# Altium project upscal.PrjPcb
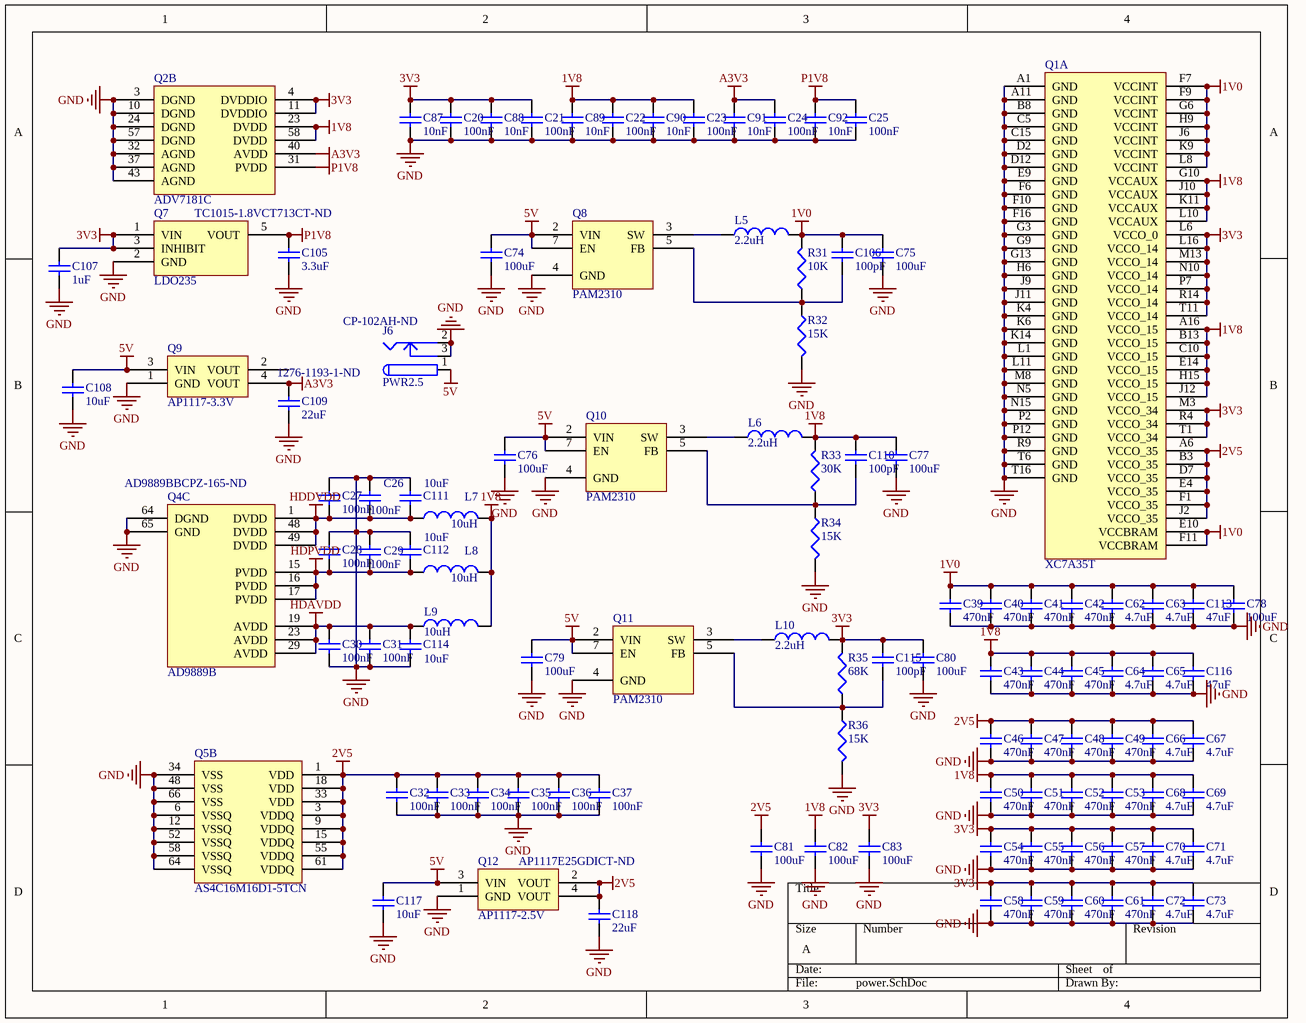
[diagram p0: power.SchDoc]
6 sheets, 230 parts. Net scope: global (net labels, ports and power ports of the same name join across sheets).
Board file: pcb.PcbDoc
Sheets:
  power.SchDoc
  input.SchDoc
  fpga.SchDoc
  hdmi.SchDoc
  mem.SchDoc
  io.SchDoc

## Sheet power.SchDoc
size A

### Parts
C20  value 100nF  [CAPC1005X06L]  (hidden comment: Cap)
C21  value 100nF  [CAPC1005X06L]  (hidden comment: Cap)
C22  value 100nF  [CAPC1005X06L]  (hidden comment: Cap)
C23  value 100nF  [CAPC1005X06L]  (hidden comment: Cap)
C24  value 100nF  [CAPC1005X06L]  (hidden comment: Cap)
C25  value 100nF  [CAPC1005X06L]  (hidden comment: Cap)
C26  value 100nF  [CAPC1005X06L]  (hidden comment: Cap)
C27  value 100nF  [CAPC1005X06L]  (hidden comment: Cap)
C28  value 100nF  [CAPC1005X06L]  (hidden comment: Cap)
C29  value 100nF  [CAPC1005X06L]  (hidden comment: Cap)
C30  value 100nF  [CAPC1005X06L]  (hidden comment: Cap)
C31  value 100nF  [CAPC1005X06L]  (hidden comment: Cap)
C32  value 100nF  [CAPC1005X06L]  (hidden comment: Cap)
C33  value 100nF  [CAPC1005X06L]  (hidden comment: Cap)
C34  value 100nF  [CAPC1005X06L]  (hidden comment: Cap)
C35  value 100nF  [CAPC1005X06L]  (hidden comment: Cap)
C36  value 100nF  [CAPC1005X06L]  (hidden comment: Cap)
C37  value 100nF  [CAPC1005X06L]  (hidden comment: Cap)
C39  value 470nF  [CAPC1005X06L]  (hidden comment: Cap)
C40  value 470nF  [CAPC1005X06L]  (hidden comment: Cap)
C41  value 470nF  [CAPC1005X06L]  (hidden comment: Cap)
C42  value 470nF  [CAPC1005X06L]  (hidden comment: Cap)
C43  value 470nF  [CAPC1005X06L]  (hidden comment: Cap)
C44  value 470nF  [CAPC1005X06L]  (hidden comment: Cap)
C45  value 470nF  [CAPC1005X06L]  (hidden comment: Cap)
C46  value 470nF  [CAPC1005X06L]  (hidden comment: Cap)
C47  value 470nF  [CAPC1005X06L]  (hidden comment: Cap)
C48  value 470nF  [CAPC1005X06L]  (hidden comment: Cap)
C49  value 470nF  [CAPC1005X06L]  (hidden comment: Cap)
C50  value 470nF  [CAPC1005X06L]  (hidden comment: Cap)
C51  value 470nF  [CAPC1005X06L]  (hidden comment: Cap)
C52  value 470nF  [CAPC1005X06L]  (hidden comment: Cap)
C53  value 470nF  [CAPC1005X06L]  (hidden comment: Cap)
C54  value 470nF  [CAPC1005X06L]  (hidden comment: Cap)
C55  value 470nF  [CAPC1005X06L]  (hidden comment: Cap)
C56  value 470nF  [CAPC1005X06L]  (hidden comment: Cap)
C57  value 470nF  [CAPC1005X06L]  (hidden comment: Cap)
C58  value 470nF  [CAPC1005X06L]  (hidden comment: Cap)
C59  value 470nF  [CAPC1005X06L]  (hidden comment: Cap)
C60  value 470nF  [CAPC1005X06L]  (hidden comment: Cap)
C61  value 470nF  [CAPC1005X06L]  (hidden comment: Cap)
C62  value 4.7uF  [CAPC1608X90N]  (hidden comment: Cap)
C63  value 4.7uF  [CAPC1608X90N]  (hidden comment: Cap)
C64  value 4.7uF  [CAPC1608X90N]  (hidden comment: Cap)
C65  value 4.7uF  [CAPC1608X90N]  (hidden comment: Cap)
C66  value 4.7uF  [CAPC1608X90N]  (hidden comment: Cap)
C67  value 4.7uF  [CAPC1608X90N]  (hidden comment: Cap)
C68  value 4.7uF  [CAPC1608X90N]  (hidden comment: Cap)
C69  value 4.7uF  [CAPC1608X90N]  (hidden comment: Cap)
C70  value 4.7uF  [CAPC1608X90N]  (hidden comment: Cap)
C71  value 4.7uF  [CAPC1608X90N]  (hidden comment: Cap)
C72  value 4.7uF  [CAPC1608X90N]  (hidden comment: Cap)
C73  value 4.7uF  [CAPC1608X90N]  (hidden comment: Cap)
C74  value 100uF  [CAPC3216X100N]  (hidden comment: Cap)
C75  value 100uF  [CAPC3216X100N]  (hidden comment: Cap)
C76  value 100uF  [CAPC3216X100N]  (hidden comment: Cap)
C77  value 100uF  [CAPC3216X100N]  (hidden comment: Cap)
C78  value 100uF  [CAPC3216X100N]  (hidden comment: Cap)
C79  value 100uF  [CAPC3216X100N]  (hidden comment: Cap)
C80  value 100uF  [CAPC3216X100N]  (hidden comment: Cap)
C81  value 100uF  [CAPC3216X100N]  (hidden comment: Cap)
C82  value 100uF  [CAPC3216X100N]  (hidden comment: Cap)
C83  value 100uF  [CAPC3216X100N]  (hidden comment: Cap)
C87  value 10nF  [CAPC1005X06L]  (hidden comment: Cap)
C88  value 10nF  [CAPC1005X06L]  (hidden comment: Cap)
C89  value 10nF  [CAPC1005X06L]  (hidden comment: Cap)
C90  value 10nF  [CAPC1005X06L]  (hidden comment: Cap)
C91  value 10nF  [CAPC1005X06L]  (hidden comment: Cap)
C92  value 10nF  [CAPC1005X06L]  (hidden comment: Cap)
C105  value 3.3uF  [CAPC1608X90N]  (hidden comment: Cap)
C106  value 100pF  [CAPC1608X90N]  (hidden comment: Cap)
C107  value 1uF  [CAPC1608X90N]  (hidden comment: Cap)
C108  value 10uF  [CAPC1608X90N]  (hidden comment: Cap)
C109  value 22uF  Supplier Part Number 1: 1276-1193-1-ND  [CAPC1608X90N]  (hidden comment: Cap)
C110  value 100pF  [CAPC1608X90N]  (hidden comment: Cap)
C111  value 10uF  [CAPC1608X90N]  (hidden comment: Cap)
C112  value 10uF  [CAPC1608X90N]  (hidden comment: Cap)
C113  value 47uF  [CAPC2012X135N]  (hidden comment: Cap)
C114  value 10uF  [CAPC1608X90N]  (hidden comment: Cap)
C115  value 100pF  [CAPC1608X90N]  (hidden comment: Cap)
C116  value 47uF  [CAPC2012X135N]  (hidden comment: Cap)
C117  value 10uF  [CAPC1608X90N]  (hidden comment: Cap)
C118  value 22uF  [CAPC1608X90N]  (hidden comment: Cap)
J6  PWR2.5  Supplier Part Number 1: CP-102AH-ND  [PJ-102A]
L5  value 2.2uH  [NRS8030T2R2NJGJ]  (hidden comment: NRS8030T2R2NJGJ)
L6  value 2.2uH  [NRS8030T2R2NJGJ]  (hidden comment: NRS8030T2R2NJGJ)
L7  value 10uH  [CAPC3225X220N]  (hidden comment: LBC3225T100KR)
L8  value 10uH  [CAPC3225X220N]  (hidden comment: LBC3225T100KR)
L9  value 10uH  [CAPC3225X220N]  (hidden comment: LBC3225T100KR)
L10  value 2.2uH  [NRS8030T2R2NJGJ]  (hidden comment: NRS8030T2R2NJGJ)
Q1  XC7A35T  (part A of 6)
Q2  ADV7181C  [TSQFP50P1200X1200X145-64N]  (part B of 3)
Q4  AD9889B  Supplier Part Number 1: AD9889BBCPZ-165-ND  [QFN50P900X875X100_HS-65N]  (part C of 3)
Q5  AS4C16M16D1-5TCN  [TSOP65P1180X120-66N]  (part B of 2)
Q7  LDO235  Supplier Part Number 1: TC1015-1.8VCT713CT-ND  [SOT23-5]
Q8  PAM2310  [SOIC127P600X175-8AN]
Q9  AP1117-3.3V  [SOT223]
Q10  PAM2310  [SOIC127P600X175-8AN]
Q11  PAM2310  [SOIC127P600X175-8AN]
Q12  AP1117-2.5V  Supplier Part Number 1: AP1117E25GDICT-ND  [SOT223]
R31  value 10K  [CAPC1608X90N]  (hidden comment: Res3)
R32  value 15K  [CAPC1608X90N]  (hidden comment: Res3)
R33  value 30K  [CAPC1608X90N]  (hidden comment: Res3)
R34  value 15K  [CAPC1608X90N]  (hidden comment: Res3)
R35  value 68K  [CAPC1608X90N]  (hidden comment: Res3)
R36  value 15K  [CAPC1608X90N]  (hidden comment: Res3)

### Nets
1V0: C39.2 C40.2 C41.2 C42.2 C62.1 C63.1 C75.1 C78.1 C106.1 C113.1 L5.2 Q1.E10(VCCBRAM) Q1.F7(VCCINT) Q1.F9(VCCINT) Q1.F11(VCCBRAM) Q1.G6(VCCINT) Q1.H9(VCCINT) Q1.J6(VCCINT) Q1.K9(VCCINT) Q1.L8(VCCINT) R31.2
1V8: C22.2 C23.2 C43.2 C44.2 C45.2 C50.2 C51.2 C52.2 C53.2 C64.1 C65.1 C68.1 C69.1 C77.1 C82.1 C89.2 C90.2 C110.1 C116.1 L6.2 L7.2 L8.2 L9.2 Q1.A16(VCCO_15) Q1.B13(VCCO_15) Q1.C10(VCCO_15) Q1.E14(VCCO_15) Q1.G10(VCCAUX) Q1.H15(VCCO_15) Q1.J10(VCCAUX) Q1.J12(VCCO_15) Q1.K11(VCCAUX) Q1.L10(VCCAUX) Q2.23(DVDD) Q2.58(DVDD) R33.2
2V5: C32.2 C33.2 C34.2 C35.2 C36.2 C37.2 C46.2 C47.2 C48.2 C49.2 C66.1 C67.1 C81.1 C118.1 Q1.A6(VCCO_35) Q1.B3(VCCO_35) Q1.D7(VCCO_35) Q1.E4(VCCO_35) Q1.F1(VCCO_35) Q1.J2(VCCO_35) Q5.1(VDD) Q5.3(VDDQ) Q5.9(VDDQ) Q5.15(VDDQ) Q5.18(VDD) Q5.33(VDD) Q5.55(VDDQ) Q5.61(VDDQ) Q12.2(VOUT) Q12.4(VOUT)
3V3: C20.2 C21.2 C54.2 C55.2 C56.2 C57.2 C58.2 C59.2 C60.2 C61.2 C70.1 C71.1 C72.1 C73.1 C80.1 C83.1 C87.2 C88.2 C107.1 C115.1 L10.2 Q1.L6(VCCO_0) Q1.L16(VCCO_14) Q1.M3(VCCO_34) Q1.M13(VCCO_14) Q1.N10(VCCO_14) Q1.P7(VCCO_14) Q1.R4(VCCO_34) Q1.R14(VCCO_14) Q1.T1(VCCO_34) Q1.T11(VCCO_14) Q2.4(DVDDIO) Q2.11(DVDDIO) Q7.1(VIN) Q7.3(INHIBIT) R35.2
5V: C74.1 C76.1 C79.1 C108.1 C117.1 J6.1 Q8.2(VIN) Q8.7(EN) Q9.3(VIN) Q10.2(VIN) Q10.7(EN) Q11.2(VIN) Q11.7(EN) Q12.3(VIN)
A3V3: C24.2 C91.2 C109.1 Q2.40(AVDD) Q9.4(VOUT)
GND: C20.1 C21.1 C22.1 C23.1 C24.1 C25.1 C26.2 C27.2 C28.2 C29.2 C30.1 C31.1 C32.1 C33.1 C34.1 C35.1 C36.1 C37.1 C39.1 C40.1 C41.1 C42.1 C43.1 C44.1 C45.1 C46.1 C47.1 C48.1 C49.1 C50.1 C51.1 C52.1 C53.1 C54.1 C55.1 C56.1 C57.1 C58.1 C59.1 C60.1 C61.1 C62.2 C63.2 C64.2 C65.2 C66.2 C67.2 C68.2 C69.2 C70.2 C71.2 C72.2 C73.2 C74.2 C75.2 C76.2 C77.2 C78.2 C79.2 C80.2 C81.2 C82.2 C83.2 C87.1 C88.1 C89.1 C90.1 C91.1 C92.1 C105.2 C107.2 C108.2 C109.2 C111.1 C112.1 C113.2 C114.2 C116.2 C117.2 C118.2 J6.2 J6.3 Q1.A1(GND) Q1.A11(GND) Q1.B8(GND) Q1.C5(GND) Q1.C15(GND) Q1.D2(GND) Q1.D12(GND) Q1.E9(GND) Q1.F6(GND) Q1.F10(GND) Q1.F16(GND) Q1.G3(GND) Q1.G9(GND) Q1.G13(GND) Q1.H6(GND) Q1.J9(GND) Q1.J11(GND) Q1.K4(GND) Q1.K6(GND) Q1.K14(GND) Q1.L1(GND) Q1.L11(GND) Q1.M8(GND) Q1.N5(GND) Q1.N15(GND) Q1.P2(GND) Q1.P12(GND) Q1.R9(GND) Q1.T6(GND) Q1.T16(GND) Q2.3(DGND) Q2.10(DGND) Q2.24(DGND) Q2.32(AGND) Q2.37(AGND) Q2.43(AGND) Q2.57(DGND) Q4.64(DGND) Q4.65(GND) Q5.6(VSSQ) Q5.12(VSSQ) Q5.34(VSS) Q5.48(VSS) Q5.52(VSSQ) Q5.58(VSSQ) Q5.64(VSSQ) Q5.66(VSS) Q7.2(GND) Q8.4(GND) Q9.1(GND) Q10.4(GND) Q11.4(GND) Q12.1(GND) R32.2 R34.2 R36.2
HDAVDD: C30.2 C31.2 C114.1 L9.1 Q4.19(AVDD) Q4.23(AVDD) Q4.29(AVDD)
HDDVDD: C26.1 C27.1 C111.2 L7.1 Q4.1(DVDD) Q4.48(DVDD) Q4.49(DVDD)
HDPVDD: C28.1 C29.1 C112.2 L8.1 Q4.15(PVDD) Q4.16(PVDD) Q4.17(PVDD)
P1V8: C25.2 C92.2 C105.1 Q2.31(PVDD) Q7.5(VOUT)
NetC106_2: C106.2 Q8.5(FB) R31.1 R32.1
NetC110_2: C110.2 Q10.5(FB) R33.1 R34.1
NetC115_2: C115.2 Q11.5(FB) R35.1 R36.1
NetL5_1: L5.1 Q8.3(SW)
NetL6_1: L6.1 Q10.3(SW)
NetL10_1: L10.1 Q11.3(SW)

Not connected (* = marked no-connect by the designer): Q9 2(VOUT)

### Library data of the parts
C20-C37 C39-C83 C87-C92 C105-C118 = Cap: Capacitor; Published: 8-Jun-2000; LatestRevisionDate: 17-Jul-2002; LatestRevisionNote: Re-released for DXP Platform.; PackageReference: RAD-0.3; Publisher: Altium Limited; PackageDescription: Radial Cap, Thru-Hole; 2 Leads; 0.3 in Pin Spacing
  C39-C61: Supplier 1: Digi-Key; Supplier Part Number 1: 490-3266-1-ND
  C62-C73: Supplier 1: Digi-Key; Supplier Part Number 1: 490-3297-1-ND
  C74 C76 C79: Supplier 1: Digi-Key; Supplier Part Number 1: 490-4512-1-ND
  C75 C77 C78 C80-C83: Supplier 1: Digi-Key; Supplier Part Number 1: 490-9966-1-ND
  C87-C92: Supplier 1: Digi-Key; Supplier Part Number 1: 1276-1057-1-ND
  C105: Supplier 1: Digi-Key; Supplier Part Number 1: 1276-1893-1-ND
  C106 C110 C115: Supplier 1: Digi-Key; Supplier Part Number 1: 1276-1909-1-ND
  C107: Supplier 1: Digi-Key; Supplier Part Number 1: 1276-1024-1-ND
  C108 C111 C112 C114 C117: Supplier 1: Digi-Key; Supplier Part Number 1: 1276-1119-1-ND
  C109: Supplier 1: Digi-Key
  C113 C116: Supplier 1: Digi-Key; Supplier Part Number 1: 490-6469-1-ND
  C118: Supplier 1: Digi-Key; Supplier Part Number 1: 1276-1193-1-ND
J6 = PWR2.5: Low Voltage Power Supply Connector; Published: 17-Dec-2003; DatasheetDocument: 09-May-2002; Publisher: Altium Limited; ComponentLink1Description: Manufacturer Link; ComponentLink1URL: http://domino.kycon.com/internet/Products.html; Supplier 1: Digi-Key
L5-L10 = Inductor: Code_IEC: 1005; Published: 8-Jun-2000; LatestRevisionDate: 29-May-2009; LatestRevisionNote: IPC-7351 Footprint Added.; PackageReference: 0402-A; Publisher: Altium Limited; PackageDescription: Chip Inductor; Code_JEITA: 0402; Supplier 1: Digi-Key
  L5 L6 L10: Supplier Part Number 1: 587-2965-1-ND
  L7-L9: Supplier Part Number 1: 587-2421-1-ND
Q5 = DDR256: Supplier 1: Digi-Key; Supplier Part Number 1: 1450-1000-ND
Q9 Q12 = AP1117: Supplier 1: Digi-Key
  Q9: Supplier Part Number 1: AP1117E33GDICT-ND
R31-R36 = Res3: Resistor; Published: 8-Jun-2000; LatestRevisionDate: 29-May-2009; LatestRevisionNote: IPC-7351 Footprint Added.; PackageReference: J1-0603; Publisher: Altium Limited; PackageDescription: Chip Resistor; Supplier 1: Digi-Key
  R31: Supplier Part Number 1: 1276-3485-1-ND
  R32 R34 R36: Supplier Part Number 1: 1276-4758-1-ND
  R33: Supplier Part Number 1: 1276-4786-1-ND
  R35: Supplier Part Number 1: 1276-4823-1-ND
Q4 = AD9889B: Supplier 1: Digi-Key
Q7 = LDO235: Supplier 1: Digi-Key
Q8 Q10 Q11 = PAM2310: Supplier 1: Digi-Key; Supplier Part Number 1: PAM2310BECADJRDICT-ND

## Sheet input.SchDoc
size A
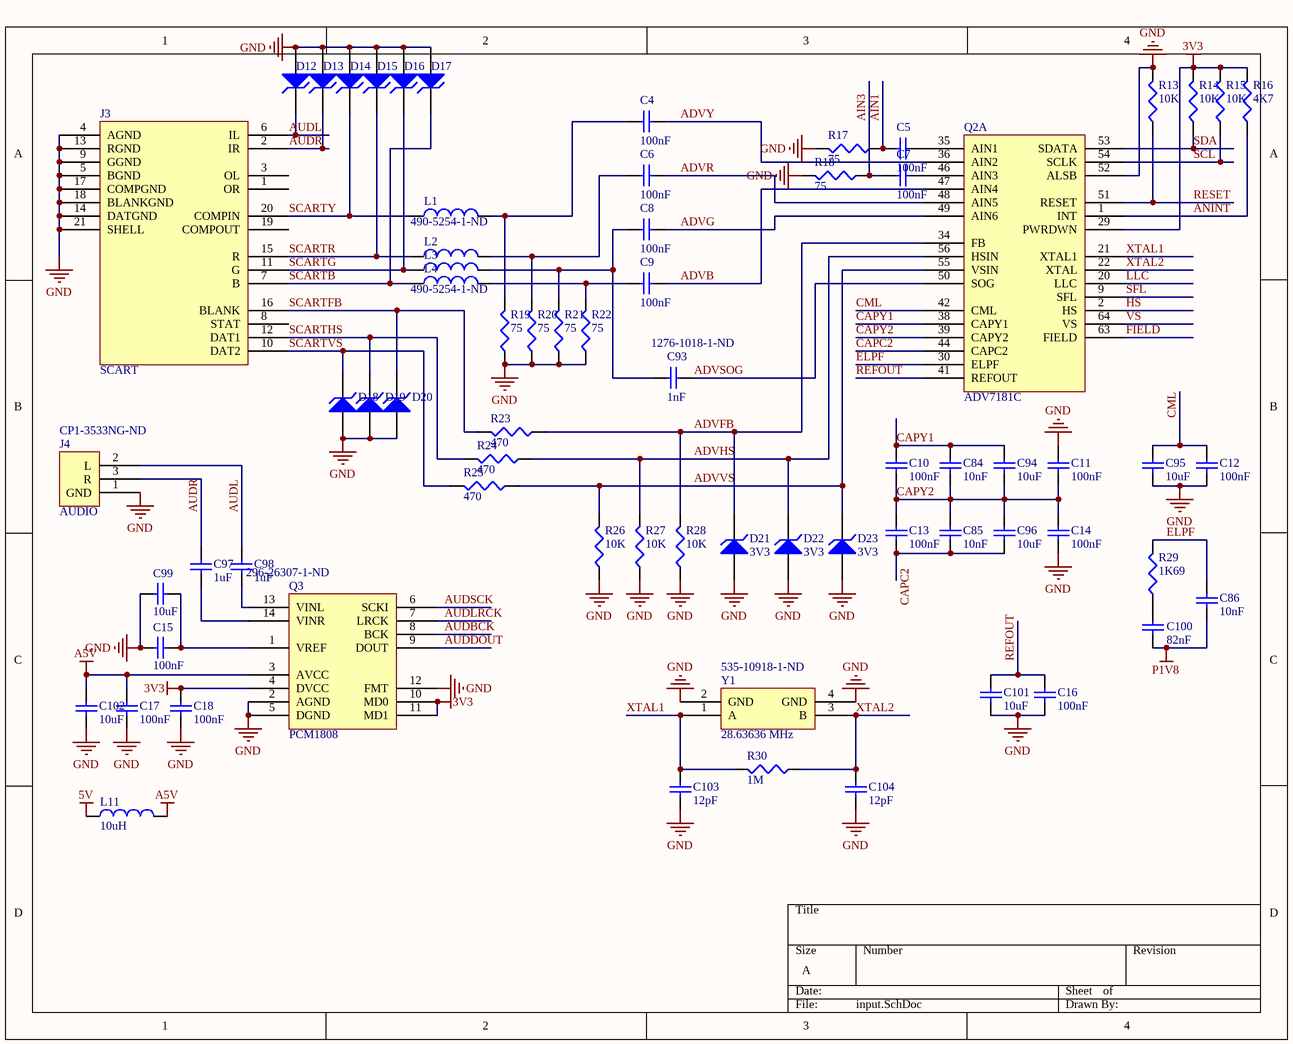
[diagram p1: input.SchDoc]

### Parts
C4  value 100nF  [CAPC1005X06L]  (hidden comment: Cap)
C5  value 100nF  [CAPC1005X06L]  (hidden comment: Cap)
C6  value 100nF  [CAPC1005X06L]  (hidden comment: Cap)
C7  value 100nF  [CAPC1005X06L]  (hidden comment: Cap)
C8  value 100nF  [CAPC1005X06L]  (hidden comment: Cap)
C9  value 100nF  [CAPC1005X06L]  (hidden comment: Cap)
C10  value 100nF  [CAPC1005X06L]  (hidden comment: Cap)
C11  value 100nF  [CAPC1005X06L]  (hidden comment: Cap)
C12  value 100nF  [CAPC1005X06L]  (hidden comment: Cap)
C13  value 100nF  [CAPC1005X06L]  (hidden comment: Cap)
C14  value 100nF  [CAPC1005X06L]  (hidden comment: Cap)
C15  value 100nF  [CAPC1005X06L]  (hidden comment: Cap)
C16  value 100nF  [CAPC1005X06L]  (hidden comment: Cap)
C17  value 100nF  [CAPC1005X06L]  (hidden comment: Cap)
C18  value 100nF  [CAPC1005X06L]  (hidden comment: Cap)
C84  value 10nF  [CAPC1005X06L]  (hidden comment: Cap)
C85  value 10nF  [CAPC1005X06L]  (hidden comment: Cap)
C86  value 10nF  [CAPC1005X06L]  (hidden comment: Cap)
C93  value 1nF  Supplier Part Number 1: 1276-1018-1-ND  [CAPC1608X90N]  (hidden comment: Cap)
C94  value 10uF  [CAPC1608X90N]  (hidden comment: Cap)
C95  value 10uF  [CAPC1608X90N]  (hidden comment: Cap)
C96  value 10uF  [CAPC1608X90N]  (hidden comment: Cap)
C97  value 1uF  [CAPC1608X90N]  (hidden comment: Cap)
C98  value 1uF  [CAPC1608X90N]  (hidden comment: Cap)
C99  value 10uF  [CAPC1608X90N]  (hidden comment: Cap)
C100  value 82nF  [CAPC1608X90N]  (hidden comment: Cap)
C101  value 10uF  [CAPC1608X90N]  (hidden comment: Cap)
C102  value 10uF  [CAPC1608X90N]  (hidden comment: Cap)
C103  value 12pF  [CAPC1608X90N]  (hidden comment: Cap)
C104  value 12pF  [CAPC1608X90N]  (hidden comment: Cap)
D12  EZAEG2A  [CAPC1005X55N]  (value not drawn)
D13  EZAEG2A  [CAPC1005X55N]  (value not drawn)
D14  EZAEG2A  [CAPC1005X55N]  (value not drawn)
D15  EZAEG2A  [CAPC1005X55N]  (value not drawn)
D16  EZAEG2A  [CAPC1005X55N]  (value not drawn)
D17  EZAEG2A  [CAPC1005X55N]  (value not drawn)
D18  EZAEG2A  [CAPC1005X55N]  (value not drawn)
D19  EZAEG2A  [CAPC1005X55N]  (value not drawn)
D20  EZAEG2A  [CAPC1005X55N]  (value not drawn)
D21  3V3  [SOD323]
D22  3V3  [SOD323]
D23  3V3  [SOD323]
J3  SCART  [SCART]
J4  AUDIO  Supplier Part Number 1: CP1-3533NG-ND  [SJ1-3533NG]
L1  Supplier Part Number 1: 490-5254-1-ND  [CAPC1608X90N]
L2  (no value)  [CAPC1608X90N]
L3  (no value)  [CAPC1608X90N]
L4  Supplier Part Number 1: 490-5254-1-ND  [CAPC1608X90N]
L11  value 10uH  [CAPC3225X220N]  (hidden comment: LBC3225T100KR)
Q2  ADV7181C  [TSQFP50P1200X1200X145-64N]  (part A of 3)
Q3  PCM1808  Supplier Part Number 1: 296-26307-1-ND  [TSOP65P640X120-14N]
R13  value 10K  [CAPC1608X90N]  (hidden comment: Res3)
R14  value 10K  [CAPC1608X90N]  (hidden comment: Res3)
R15  value 10K  [CAPC1608X90N]  (hidden comment: Res3)
R16  value 4K7  [CAPC1608X90N]  (hidden comment: Res3)
R17  value 75  [CAPC1608X90N]  (hidden comment: Res3)
R18  value 75  [CAPC1608X90N]  (hidden comment: Res3)
R19  value 75  [CAPC1608X90N]  (hidden comment: Res3)
R20  value 75  [CAPC1608X90N]  (hidden comment: Res3)
R21  value 75  [CAPC1608X90N]  (hidden comment: Res3)
R22  value 75  [CAPC1608X90N]  (hidden comment: Res3)
R23  value 470  [CAPC2012X135N]  (hidden comment: Res3)
R24  value 470  [CAPC2012X135N]  (hidden comment: Res3)
R25  value 470  [CAPC2012X135N]  (hidden comment: Res3)
R26  value 10K  [CAPC1608X90N]  (hidden comment: Res3)
R27  value 10K  [CAPC1608X90N]  (hidden comment: Res3)
R28  value 10K  [CAPC1608X90N]  (hidden comment: Res3)
R29  value 1K69  [CAPC1608X90N]  (hidden comment: Res3)
R30  value 1M  [CAPC1608X90N]  (hidden comment: Res3)
Y1  28.63636 MHz  Supplier Part Number 1: 535-10918-1-ND  [ABM8G]

### Nets
3V3: C18.1 Q2.29(PWRDWN) Q3.4(DVCC) Q3.10(MD0) Q3.11(MD1) R14.2 R15.2 R16.2
5V: L11.1
A5V: C17.1 C102.1 L11.2 Q3.3(AVCC)
GND: C11.2 C12.1 C14.1 C15.2 C16.1 C17.2 C18.2 C95.1 C99.2 C101.1 C102.2 C103.1 C104.1 D12.1(A) D13.1(A) D14.1(A) D15.1(A) D16.1(A) D17.1(A) D18.1(A) D19.1(A) D20.1(A) D21.A D22.A D23.A J3.4(AGND) J3.5(BGND) J3.9(GGND) J3.13(RGND) J3.14(DATGND) J3.17(COMPGND) J3.18(BLANKGND) J3.21(SHELL) J4.1(GND) Q2.52(ALSB) Q3.2(AGND) Q3.5(DGND) Q3.12(FMT) R13.2 R17.2 R18.2 R19.1 R20.1 R21.1 R22.1 R26.1 R27.1 R28.1 Y1.2(GND) Y1.4(GND)
P1V8: C86.1 C100.1
ADVB: C9.2 Q2.47(AIN4)
ADVFB: D21.K Q2.34(FB) R23.1 R28.2
ADVG: C8.2 Q2.49(AIN6)
ADVHS: D22.K Q2.56(HSIN) R24.1 R27.2
ADVR: C6.2 Q2.48(AIN5)
ADVSOG: C93.2 Q2.50(SOG)
ADVVS: D23.K Q2.55(VSIN) R25.1 R26.2
ADVY: C4.2 Q2.36(AIN2)
AIN1: C5.1 R17.1
AIN3: C7.1 R18.1
ANINT: Q2.1(INT) R16.1
AUDBCK: Q3.8(BCK)
AUDDOUT: Q3.9(DOUT)
AUDL: C98.1 D12.2(K) J3.6(IL) J4.2(L)
AUDLRCK: Q3.7(LRCK)
AUDR: C97.1 D13.2(K) J3.2(IR) J4.3(R)
AUDSCK: Q3.6(SCKI)
CAPC2: C13.1 C85.1 C96.1 Q2.44(CAPC2)
CAPY1: C10.2 C84.2 C94.2 Q2.38(CAPY1)
CAPY2: C10.1 C11.1 C13.2 C14.2 C84.1 C85.2 C94.1 C96.2 Q2.39(CAPY2)
CML: C12.2 C95.2 Q2.42(CML)
ELPF: C86.2 Q2.30(ELPF) R29.2
FIELD: Q2.63(FIELD)
HS: Q2.2(HS)
LLC: Q2.20(LLC)
REFOUT: C16.2 C101.2 Q2.41(REFOUT)
RESET: Q2.51(RESET) R13.1
SCARTB: D17.2(K) J3.7(B) L4.1
SCARTFB: D20.2(K) J3.16(BLANK) R23.2
SCARTG: D16.2(K) J3.11(G) L3.1
SCARTHS: D19.2(K) J3.12(DAT1) R24.2
SCARTR: D15.2(K) J3.15(R) L2.1
SCARTVS: D18.2(K) J3.10(DAT2) R25.2
SCARTY: D14.2(K) J3.20(COMPIN) L1.1
SCL: Q2.54(SCLK) R15.1
SDA: Q2.53(SDATA) R14.1
SFL: Q2.9(SFL)
VS: Q2.64(VS)
XTAL1: C103.2 Q2.21(XTAL1) R30.2 Y1.1(A)
XTAL2: C104.2 Q2.22(XTAL) R30.1 Y1.3(B)
NetC4_1: C4.1 L1.2 R19.2
NetC5_2: C5.2 Q2.35(AIN1)
NetC6_1: C6.1 L2.2 R20.2
NetC7_2: C7.2 Q2.46(AIN3)
NetC8_1: C8.1 C93.1 L3.2 R21.2
NetC9_1: C9.1 L4.2 R22.2
NetC15_1: C15.1 C99.1 Q3.1(VREF)
NetC97_2: C97.2 Q3.14(VINR)
NetC98_2: C98.2 Q3.13(VINL)
NetC100_2: C100.2 R29.1

Not connected (* = marked no-connect by the designer): J3 1(OR) 3(OL) 8(STAT) 19(COMPOUT)

### Library data of the parts
C4-C18 C84-C86 C93-C104 = Cap: Capacitor; Published: 8-Jun-2000; LatestRevisionDate: 17-Jul-2002; LatestRevisionNote: Re-released for DXP Platform.; PackageReference: RAD-0.3; Publisher: Altium Limited; PackageDescription: Radial Cap, Thru-Hole; 2 Leads; 0.3 in Pin Spacing
  C84-C86: Supplier 1: Digi-Key; Supplier Part Number 1: 1276-1057-1-ND
  C93: Supplier 1: Digi-Key
  C94-C96 C99 C101 C102: Supplier 1: Digi-Key; Supplier Part Number 1: 1276-1119-1-ND
  C97 C98: Supplier 1: Digi-Key; Supplier Part Number 1: 1276-1024-1-ND
  C100: Supplier 1: Digi-Key; Supplier Part Number 1: 1276-2121-1-ND
  C103 C104: Supplier 1: Digi-Key; Supplier Part Number 1: 1276-2175-1-ND
D12-D23 = D Zener: Zener Diode; Published: 8-Jun-2000; LatestRevisionDate: 17-Jul-2002; LatestRevisionNote: Re-released for DXP Platform.; PackageReference: DIODE-0.7; Publisher: Altium Limited; PackageDescription: Diode, Thru-Hole; 2 Leads; 0.7 in Pin Spacing; Supplier 1: Digi-Key
  D12-D20: Supplier Part Number 1: P13571CT-ND
  D21-D23: Supplier Part Number 1: MM3Z3V3T1GOSCT-ND
L1-L4 L11 = Inductor: Code_IEC: 1005; Published: 8-Jun-2000; LatestRevisionDate: 29-May-2009; LatestRevisionNote: IPC-7351 Footprint Added.; PackageReference: 0402-A; Publisher: Altium Limited; PackageDescription: Chip Inductor; Code_JEITA: 0402; Supplier 1: Digi-Key
  L2 L3: Supplier Part Number 1: 490-5254-1-ND
  L11: Supplier Part Number 1: 587-2421-1-ND
R13-R30 = Res3: Resistor; Published: 8-Jun-2000; LatestRevisionDate: 29-May-2009; LatestRevisionNote: IPC-7351 Footprint Added.; PackageReference: J1-0603; Publisher: Altium Limited; PackageDescription: Chip Resistor; Supplier 1: Digi-Key
  R13-R15 R26-R28: Supplier Part Number 1: 1276-3485-1-ND
  R16: Supplier Part Number 1: 1276-5078-1-ND
  R17-R22: Supplier Part Number 1: 1276-3508-1-ND
  R23-R25: Supplier Part Number 1: P470ADCT-ND
  R29: Supplier Part Number 1: 1276-3491-1-ND
  R30: Supplier Part Number 1: 1276-5134-1-ND
Y1 = XTAL: Supplier 1: Digi-Key
J4 = AUDIO: Supplier 1: Digi-Key
Q2 = ADV7181C: Supplier 1: Digi-Key; Supplier Part Number 1: ADV7181CBSTZ-ND
Q3 = PCM1808: Supplier 1: Digi-Key

## Sheet fpga.SchDoc
size A
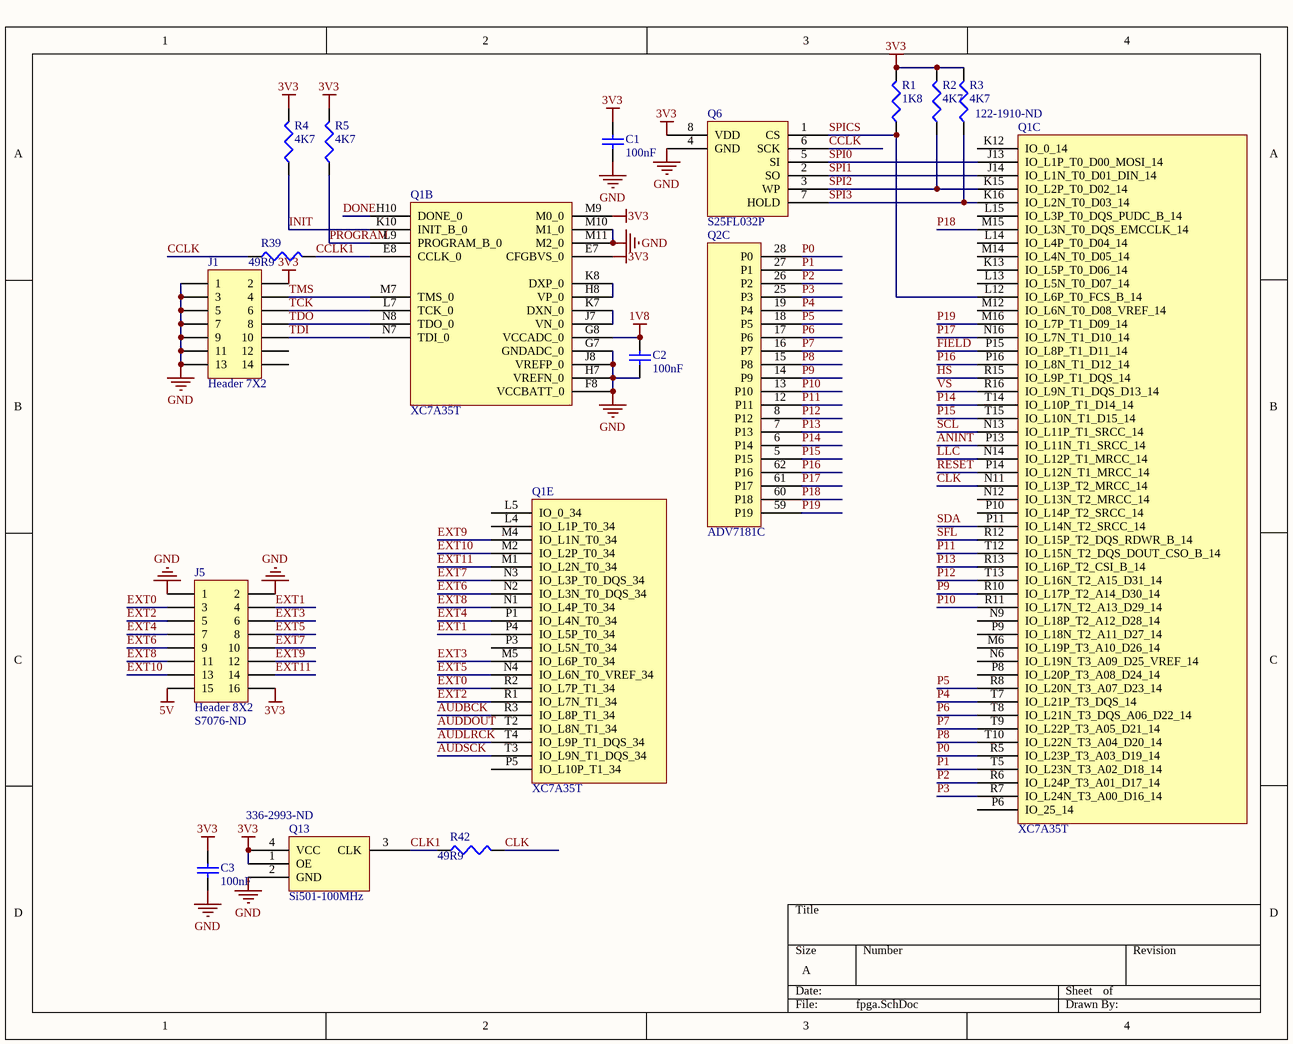
[diagram p2: fpga.SchDoc]

### Parts
C1  value 100nF  [CAPC1005X06L]  (hidden comment: Cap)
C2  value 100nF  [CAPC1005X06L]  (hidden comment: Cap)
C3  value 100nF  [CAPC1005X06L]  (hidden comment: Cap)
J1  Header 7X2  [HDR2X7]
J5  Header 8X2  Supplier Part Number 1: S7076-ND  [HDR2X8]
Q1  XC7A35T  (parts B,C,E of 6)
Q2  ADV7181C  [TSQFP50P1200X1200X145-64N]  (part C of 3)
Q6  S25FL032P  [SOIC127P600X175-8AN]
Q13  Si501-100MHz  Supplier Part Number 1: 336-2993-ND  [Si501_225]
R1  value 1K8  [CAPC1608X90N]  (hidden comment: Res3)
R2  value 4K7  [CAPC1608X90N]  (hidden comment: Res3)
R3  value 4K7  [CAPC1608X90N]  (hidden comment: Res3)
R4  value 4K7  [CAPC1608X90N]  (hidden comment: Res3)
R5  value 4K7  [CAPC1608X90N]  (hidden comment: Res3)
R39  value 49R9  [CAPC1005X06L]  (hidden comment: Res3)
R42  value 49R9  [CAPC1005X06L]  (hidden comment: Res3)

### Nets
1V8: C2.2 Q1.G8(VCCADC_0)
3V3: C1.2 C3.2 J1.2 J5.16 Q1.E7(CFGBVS_0) Q1.M9(M0_0) Q6.8(VDD) Q13.1(OE) Q13.4(VCC) R1.2 R2.2 R3.2 R4.2 R5.2
5V: J5.15
GND: C1.1 C2.1 C3.1 J1.1 J1.3 J1.5 J1.7 J1.9 J1.11 J1.13 J5.1 J5.2 Q1.F8(VCCBATT_0) Q1.G7(GNDADC_0) Q1.H7(VREFN_0) Q1.J8(VREFP_0) Q1.M10(M1_0) Q1.M11(M2_0) Q6.4(GND) Q13.2(GND)
ANINT: Q1.P13(IO_L11N_T1_SRCC_14)
AUDBCK: Q1.R3(IO_L8P_T1_34)
AUDDOUT: Q1.T2(IO_L8N_T1_34)
AUDLRCK: Q1.T4(IO_L9P_T1_DQS_34)
AUDSCK: Q1.T3(IO_L9N_T1_DQS_34)
CCLK: Q6.6(SCK) R39.1
CCLK1: Q1.E8(CCLK_0) R39.2
CLK: Q1.N11(IO_L13P_T2_MRCC_14) R42.2
CLK1: Q13.3(CLK) R42.1
DONE: Q1.H10(DONE_0)
EXT0: J5.3 Q1.R2(IO_L7P_T1_34)
EXT1: J5.4 Q1.P4(IO_L5P_T0_34)
EXT2: J5.5 Q1.R1(IO_L7N_T1_34)
EXT3: J5.6 Q1.M5(IO_L6P_T0_34)
EXT4: J5.7 Q1.P1(IO_L4N_T0_34)
EXT5: J5.8 Q1.N4(IO_L6N_T0_VREF_34)
EXT6: J5.9 Q1.N2(IO_L3N_T0_DQS_34)
EXT7: J5.10 Q1.N3(IO_L3P_T0_DQS_34)
EXT8: J5.11 Q1.N1(IO_L4P_T0_34)
EXT9: J5.12 Q1.M4(IO_L1N_T0_34)
EXT10: J5.13 Q1.M2(IO_L2P_T0_34)
EXT11: J5.14 Q1.M1(IO_L2N_T0_34)
FIELD: Q1.P15(IO_L8P_T1_D11_14)
HS: Q1.R15(IO_L9P_T1_DQS_14)
INIT: Q1.K10(INIT_B_0) R4.1
LLC: Q1.N14(IO_L12P_T1_MRCC_14)
P0: Q1.R5(IO_L23P_T3_A03_D19_14) Q2.28(P0)
P1: Q1.T5(IO_L23N_T3_A02_D18_14) Q2.27(P1)
P2: Q1.R6(IO_L24P_T3_A01_D17_14) Q2.26(P2)
P3: Q1.R7(IO_L24N_T3_A00_D16_14) Q2.25(P3)
P4: Q1.T7(IO_L21P_T3_DQS_14) Q2.19(P4)
P5: Q1.R8(IO_L20N_T3_A07_D23_14) Q2.18(P5)
P6: Q1.T8(IO_L21N_T3_DQS_A06_D22_14) Q2.17(P6)
P7: Q1.T9(IO_L22P_T3_A05_D21_14) Q2.16(P7)
P8: Q1.T10(IO_L22N_T3_A04_D20_14) Q2.15(P8)
P9: Q1.R10(IO_L17P_T2_A14_D30_14) Q2.14(P9)
P10: Q1.R11(IO_L17N_T2_A13_D29_14) Q2.13(P10)
P11: Q1.T12(IO_L15N_T2_DQS_DOUT_CSO_B_14) Q2.12(P11)
P12: Q1.T13(IO_L16N_T2_A15_D31_14) Q2.8(P12)
P13: Q1.R13(IO_L16P_T2_CSI_B_14) Q2.7(P13)
P14: Q1.T14(IO_L10P_T1_D14_14) Q2.6(P14)
P15: Q1.T15(IO_L10N_T1_D15_14) Q2.5(P15)
P16: Q1.P16(IO_L8N_T1_D12_14) Q2.62(P16)
P17: Q1.N16(IO_L7N_T1_D10_14) Q2.61(P17)
P18: Q1.M15(IO_L3N_T0_DQS_EMCCLK_14) Q2.60(P18)
P19: Q1.M16(IO_L7P_T1_D09_14) Q2.59(P19)
PROGRAM: Q1.L9(PROGRAM_B_0) R5.1
RESET: Q1.P14(IO_L12N_T1_MRCC_14)
SCL: Q1.N13(IO_L11P_T1_SRCC_14)
SDA: Q1.P11(IO_L14N_T2_SRCC_14)
SFL: Q1.R12(IO_L15P_T2_DQS_RDWR_B_14)
SPI0: Q1.J13(IO_L1P_T0_D00_MOSI_14) Q6.5(SI)
SPI1: Q1.J14(IO_L1N_T0_D01_DIN_14) Q6.2(SO)
SPI2: Q1.K15(IO_L2P_T0_D02_14) Q6.3(WP) R2.1
SPI3: Q1.K16(IO_L2N_T0_D03_14) Q6.7(HOLD) R3.1
SPICS: Q1.L12(IO_L6P_T0_FCS_B_14) Q6.1(CS) R1.1
TCK: J1.6 Q1.L7(TCK_0)
TDI: J1.10 Q1.N7(TDI_0)
TDO: J1.8 Q1.N8(TDO_0)
TMS: J1.4 Q1.M7(TMS_0)
VS: Q1.R16(IO_L9N_T1_DQS_D13_14)
NetQ1_H8: Q1.H8(VP_0) Q1.K8(DXP_0)
NetQ1_J7: Q1.J7(VN_0) Q1.K7(DXN_0)

Not connected (* = marked no-connect by the designer): J1 12 14; Q1 K12(IO_0_14) K13(IO_L5P_T0_D06_14) L4(IO_L1P_T0_34) L5(IO_0_34) L13(IO_L5N_T0_D07_14) L14(IO_L4P_T0_D04_14) L15(IO_L3P_T0_DQS_PUDC_B_14) M6(IO_L19P_T3_A10_D26_14) M12(IO_L6N_T0_D08_VREF_14) M14(IO_L4N_T0_D05_14) N6(IO_L19N_T3_A09_D25_VREF_14) N9(IO_L18P_T2_A12_D28_14) N12(IO_L13N_T2_MRCC_14) P3(IO_L5N_T0_34) P5(IO_L10P_T1_34) P6(IO_25_14) P8(IO_L20P_T3_A08_D24_14) P9(IO_L18N_T2_A11_D27_14) P10(IO_L14P_T2_SRCC_14)

### Library data of the parts
C1-C3 = Cap: Capacitor; Published: 8-Jun-2000; LatestRevisionDate: 17-Jul-2002; LatestRevisionNote: Re-released for DXP Platform.; PackageReference: RAD-0.3; Publisher: Altium Limited; PackageDescription: Radial Cap, Thru-Hole; 2 Leads; 0.3 in Pin Spacing
J1 = Header 7X2: Header, 7-Pin, Dual row; LatestRevisionDate: 17-Jul-2002; LatestRevisionNote: Re-released for DXP Platform.; Publisher: Altium Limited
J5 = Header 8X2: Header, 8-Pin, Dual row; LatestRevisionDate: 17-Jul-2002; LatestRevisionNote: Re-released for DXP Platform.; Publisher: Altium Limited; Supplier 1: Digi-Key
Q13 = Si501: Supplier 1: Digi-Key
R1-R5 R39 R42 = Res3: Resistor; Published: 8-Jun-2000; LatestRevisionDate: 29-May-2009; LatestRevisionNote: IPC-7351 Footprint Added.; PackageReference: J1-0603; Publisher: Altium Limited; PackageDescription: Chip Resistor; Supplier 1: Digi-Key
  R1: Supplier Part Number 1: 1276-5068-1-ND
  R2-R5: Supplier Part Number 1: 1276-5078-1-ND
  R39 R42: Supplier Part Number 1: 1276-3505-1-ND
Q6 = S25FL032P: Supplier 1: Digi-Key; Supplier Part Number 1: S25FL032P0XMFI011-ND

## Sheet hdmi.SchDoc
size A
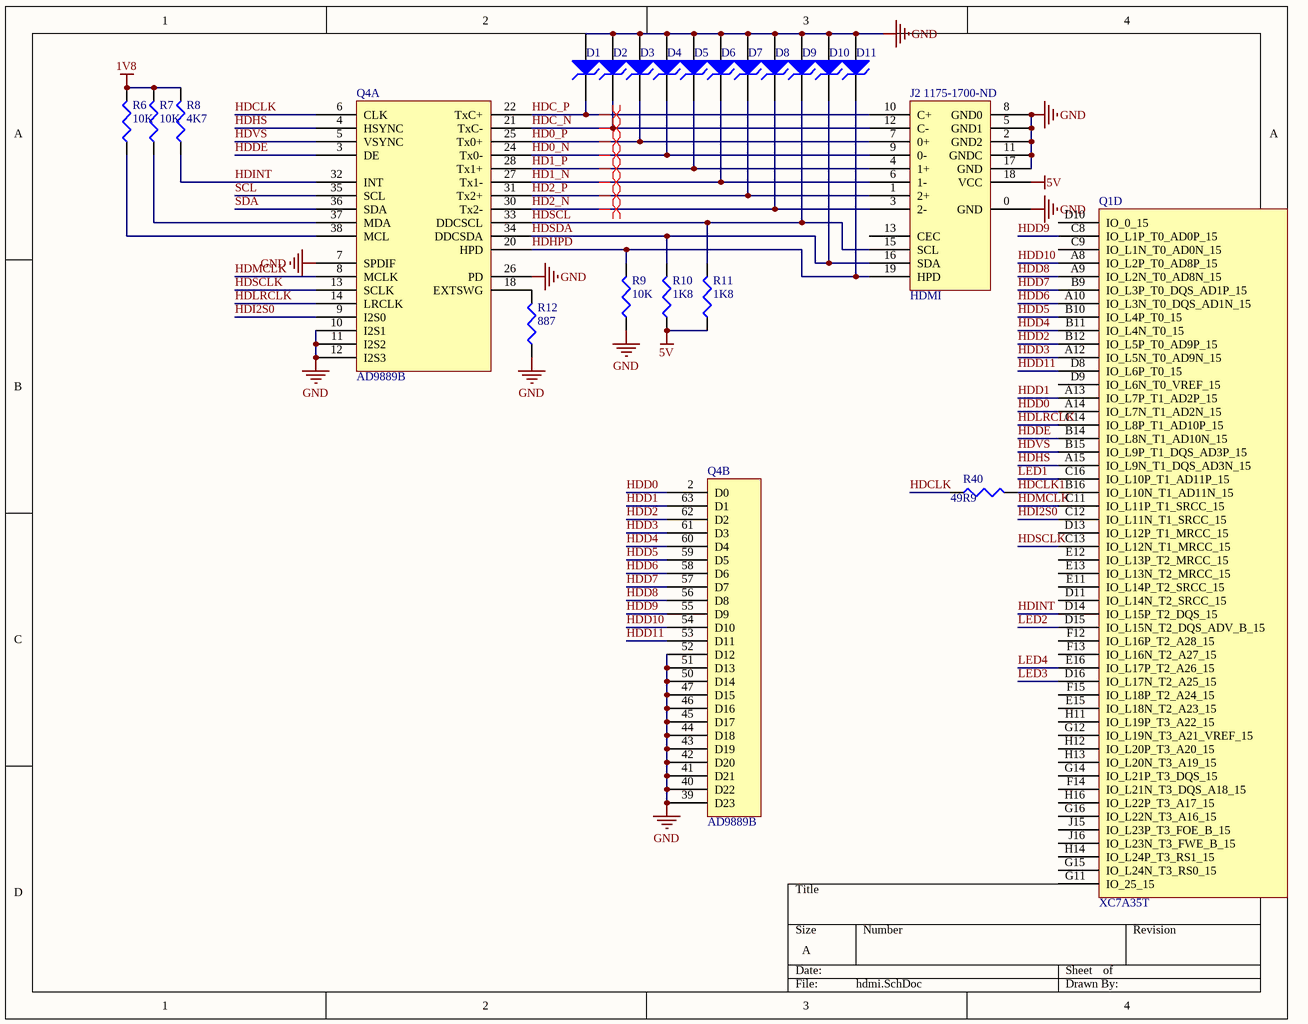
[diagram p3: hdmi.SchDoc]

### Parts
D1  EZAEG2A  [CAPC1005X55N]  (value not drawn)
D2  EZAEG2A  [CAPC1005X55N]  (value not drawn)
D3  EZAEG2A  [CAPC1005X55N]  (value not drawn)
D4  EZAEG2A  [CAPC1005X55N]  (value not drawn)
D5  EZAEG2A  [CAPC1005X55N]  (value not drawn)
D6  EZAEG2A  [CAPC1005X55N]  (value not drawn)
D7  EZAEG2A  [CAPC1005X55N]  (value not drawn)
D8  EZAEG2A  [CAPC1005X55N]  (value not drawn)
D9  EZAEG2A  [CAPC1005X55N]  (value not drawn)
D10  EZAEG2A  [CAPC1005X55N]  (value not drawn)
D11  EZAEG2A  [CAPC1005X55N]  (value not drawn)
J2  HDMI  Supplier Part Number 1: 1175-1700-ND  [2000-1-1-20-00-BK]
Q1  XC7A35T  (part D of 6)
Q4  AD9889B  [QFN50P900X875X100_HS-65N]  (parts A,B of 3)
R6  value 10K  [CAPC1608X90N]  (hidden comment: Res3)
R7  value 10K  [CAPC1608X90N]  (hidden comment: Res3)
R8  value 4K7  [CAPC1608X90N]  (hidden comment: Res3)
R9  value 10K  [CAPC1608X90N]  (hidden comment: Res3)
R10  value 1K8  [CAPC1608X90N]  (hidden comment: Res3)
R11  value 1K8  [CAPC1608X90N]  (hidden comment: Res3)
R12  value 887  [CAPC1608X90N]  (hidden comment: Res3)
R40  value 49R9  [CAPC1005X06L]  (hidden comment: Res3)

### Nets
1V8: R6.2 R7.2 R8.2
5V: J2.18(VCC) R10.1 R11.1
GND: D1.1(A) D2.1(A) D3.1(A) D4.1(A) D5.1(A) D6.1(A) D7.1(A) D8.1(A) D9.1(A) D10.1(A) D11.1(A) J2.0(GND) J2.2(GND2) J2.5(GND1) J2.8(GND0) J2.11(GNDC) J2.17(GND) Q4.7(SPDIF) Q4.10(I2S1) Q4.11(I2S2) Q4.12(I2S3) Q4.26(PD) Q4.39(D23) Q4.40(D22) Q4.41(D21) Q4.42(D20) Q4.43(D19) Q4.44(D18) Q4.45(D17) Q4.46(D16) Q4.47(D15) Q4.50(D14) Q4.51(D13) Q4.52(D12) R9.1 R12.1
HD0_N: D4.2(K) J2.9(0-) Q4.24(Tx0-)
HD0_P: D3.2(K) J2.7(0+) Q4.25(Tx0+)
HD1_N: D6.2(K) J2.6(1-) Q4.27(Tx1-)
HD1_P: D5.2(K) J2.4(1+) Q4.28(Tx1+)
HD2_N: D8.2(K) J2.3(2-) Q4.30(Tx2-)
HD2_P: D7.2(K) J2.1(2+) Q4.31(Tx2+)
HDC_N: D2.2(K) J2.12(C-) Q4.21(TxC-)
HDC_P: D1.2(K) J2.10(C+) Q4.22(TxC+)
HDCLK: Q4.6(CLK) R40.1
HDCLK1: Q1.B16(IO_L10N_T1_AD11N_15) R40.2
HDD0: Q1.A14(IO_L7N_T1_AD2N_15) Q4.2(D0)
HDD1: Q1.A13(IO_L7P_T1_AD2P_15) Q4.63(D1)
HDD2: Q1.B12(IO_L5P_T0_AD9P_15) Q4.62(D2)
HDD3: Q1.A12(IO_L5N_T0_AD9N_15) Q4.61(D3)
HDD4: Q1.B11(IO_L4N_T0_15) Q4.60(D4)
HDD5: Q1.B10(IO_L4P_T0_15) Q4.59(D5)
HDD6: Q1.A10(IO_L3N_T0_DQS_AD1N_15) Q4.58(D6)
HDD7: Q1.B9(IO_L3P_T0_DQS_AD1P_15) Q4.57(D7)
HDD8: Q1.A9(IO_L2N_T0_AD8N_15) Q4.56(D8)
HDD9: Q1.C8(IO_L1P_T0_AD0P_15) Q4.55(D9)
HDD10: Q1.A8(IO_L2P_T0_AD8P_15) Q4.54(D10)
HDD11: Q1.D8(IO_L6P_T0_15) Q4.53(D11)
HDDE: Q1.B14(IO_L8N_T1_AD10N_15) Q4.3(DE)
HDHPD: D11.2(K) J2.19(HPD) Q4.20(HPD) R9.2
HDHS: Q1.A15(IO_L9N_T1_DQS_AD3N_15) Q4.4(HSYNC)
HDI2S0: Q1.C12(IO_L11N_T1_SRCC_15) Q4.9(I2S0)
HDINT: Q1.D14(IO_L15P_T2_DQS_15) Q4.32(INT) R8.1
HDLRCLK: Q1.C14(IO_L8P_T1_AD10P_15) Q4.14(LRCLK)
HDMCLK: Q1.C11(IO_L11P_T1_SRCC_15) Q4.8(MCLK)
HDSCL: D9.2(K) J2.15(SCL) Q4.33(DDCSCL) R11.2
HDSCLK: Q1.C13(IO_L12N_T1_MRCC_15) Q4.13(SCLK)
HDSDA: D10.2(K) J2.16(SDA) Q4.34(DDCSDA) R10.2
HDVS: Q1.B15(IO_L9P_T1_DQS_AD3P_15) Q4.5(VSYNC)
LED1: Q1.C16(IO_L10P_T1_AD11P_15)
LED2: Q1.D15(IO_L15N_T2_DQS_ADV_B_15)
LED3: Q1.D16(IO_L17N_T2_A25_15)
LED4: Q1.E16(IO_L17P_T2_A26_15)
SCL: Q4.35(SCL)
SDA: Q4.36(SDA)
NetQ4_18: Q4.18(EXTSWG) R12.2
NetQ4_37: Q4.37(MDA) R7.1
NetQ4_38: Q4.38(MCL) R6.1

Not connected (* = marked no-connect by the designer): J2 13(CEC); Q1 C9(IO_L1N_T0_AD0N_15) D9(IO_L6N_T0_VREF_15) D10(IO_0_15) D11(IO_L14N_T2_SRCC_15) D13(IO_L12P_T1_MRCC_15) E11(IO_L14P_T2_SRCC_15) E12(IO_L13P_T2_MRCC_15) E13(IO_L13N_T2_MRCC_15) E15(IO_L18N_T2_A23_15) F12(IO_L16P_T2_A28_15) F13(IO_L16N_T2_A27_15) F14(IO_L21N_T3_DQS_A18_15) F15(IO_L18P_T2_A24_15) G11(IO_25_15) G12(IO_L19N_T3_A21_VREF_15) G14(IO_L21P_T3_DQS_15) G15(IO_L24N_T3_RS0_15) G16(IO_L22N_T3_A16_15) H11(IO_L19P_T3_A22_15) H12(IO_L20P_T3_A20_15) H13(IO_L20N_T3_A19_15) H14(IO_L24P_T3_RS1_15) H16(IO_L22P_T3_A17_15) J15(IO_L23P_T3_FOE_B_15) J16(IO_L23N_T3_FWE_B_15)

### Layout directives
differential pair: HD0_N, HD0_P, HD1_N, HD1_P, HD2_N, HD2_P, HDC_N, HDC_P

### Library data of the parts
D1-D11 = D Zener: Zener Diode; Published: 8-Jun-2000; LatestRevisionDate: 17-Jul-2002; LatestRevisionNote: Re-released for DXP Platform.; PackageReference: DIODE-0.7; Publisher: Altium Limited; PackageDescription: Diode, Thru-Hole; 2 Leads; 0.7 in Pin Spacing; Supplier 1: Digi-Key; Supplier Part Number 1: P13571CT-ND
R6-R12 R40 = Res3: Resistor; Published: 8-Jun-2000; LatestRevisionDate: 29-May-2009; LatestRevisionNote: IPC-7351 Footprint Added.; PackageReference: J1-0603; Publisher: Altium Limited; PackageDescription: Chip Resistor; Supplier 1: Digi-Key
  R6 R7 R9: Supplier Part Number 1: 1276-3485-1-ND
  R8: Supplier Part Number 1: 1276-5078-1-ND
  R10 R11: Supplier Part Number 1: 1276-5068-1-ND
  R12: Supplier Part Number 1: 1276-4640-1-ND
  R40: Supplier Part Number 1: 1276-3505-1-ND
J2 = HDMI: Supplier 1: Digi-Key

## Sheet mem.SchDoc
size A
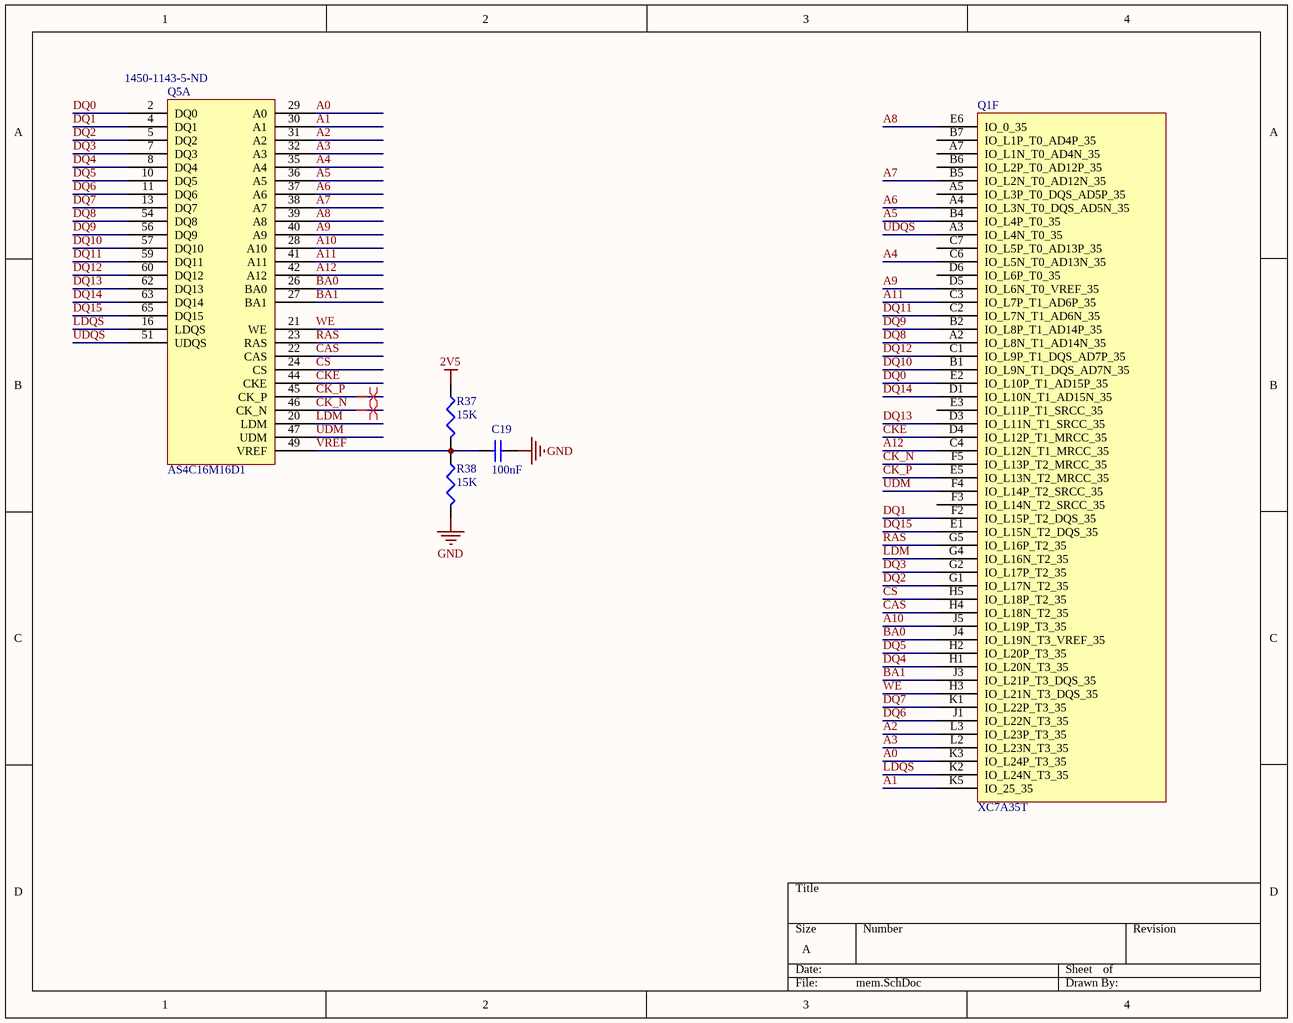
[diagram p4: mem.SchDoc]

### Parts
C19  value 100nF  [CAPC1005X06L]  (hidden comment: Cap)
Q1  XC7A35T  (part F of 6)
Q5  AS4C16M16D1  Supplier Part Number 1: 1450-1143-5-ND  [TSOP65P1180X120-66N]  (part A of 2)
R37  value 15K  [CAPC1608X90N]  (hidden comment: Res3)
R38  value 15K  [CAPC1608X90N]  (hidden comment: Res3)

### Nets
2V5: R37.1
GND: C19.2 R38.2
A0: Q1.K3(IO_L24P_T3_35) Q5.29(A0)
A1: Q1.K5(IO_25_35) Q5.30(A1)
A2: Q1.L3(IO_L23P_T3_35) Q5.31(A2)
A3: Q1.L2(IO_L23N_T3_35) Q5.32(A3)
A4: Q1.C6(IO_L5N_T0_AD13N_35) Q5.35(A4)
A5: Q1.B4(IO_L4P_T0_35) Q5.36(A5)
A6: Q1.A4(IO_L3N_T0_DQS_AD5N_35) Q5.37(A6)
A7: Q1.B5(IO_L2N_T0_AD12N_35) Q5.38(A7)
A8: Q1.E6(IO_0_35) Q5.39(A8)
A9: Q1.D5(IO_L6N_T0_VREF_35) Q5.40(A9)
A10: Q1.J5(IO_L19P_T3_35) Q5.28(A10)
A11: Q1.C3(IO_L7P_T1_AD6P_35) Q5.41(A11)
A12: Q1.C4(IO_L12N_T1_MRCC_35) Q5.42(A12)
BA0: Q1.J4(IO_L19N_T3_VREF_35) Q5.26(BA0)
BA1: Q1.J3(IO_L21P_T3_DQS_35) Q5.27(BA1)
CAS: Q1.H4(IO_L18N_T2_35) Q5.22(CAS)
CK_N: Q1.F5(IO_L13P_T2_MRCC_35) Q5.46(CK_N)
CK_P: Q1.E5(IO_L13N_T2_MRCC_35) Q5.45(CK_P)
CKE: Q1.D4(IO_L12P_T1_MRCC_35) Q5.44(CKE)
CS: Q1.H5(IO_L18P_T2_35) Q5.24(CS)
DQ0: Q1.E2(IO_L10P_T1_AD15P_35) Q5.2(DQ0)
DQ1: Q1.F2(IO_L15P_T2_DQS_35) Q5.4(DQ1)
DQ2: Q1.G1(IO_L17N_T2_35) Q5.5(DQ2)
DQ3: Q1.G2(IO_L17P_T2_35) Q5.7(DQ3)
DQ4: Q1.H1(IO_L20N_T3_35) Q5.8(DQ4)
DQ5: Q1.H2(IO_L20P_T3_35) Q5.10(DQ5)
DQ6: Q1.J1(IO_L22N_T3_35) Q5.11(DQ6)
DQ7: Q1.K1(IO_L22P_T3_35) Q5.13(DQ7)
DQ8: Q1.A2(IO_L8N_T1_AD14N_35) Q5.54(DQ8)
DQ9: Q1.B2(IO_L8P_T1_AD14P_35) Q5.56(DQ9)
DQ10: Q1.B1(IO_L9N_T1_DQS_AD7N_35) Q5.57(DQ10)
DQ11: Q1.C2(IO_L7N_T1_AD6N_35) Q5.59(DQ11)
DQ12: Q1.C1(IO_L9P_T1_DQS_AD7P_35) Q5.60(DQ12)
DQ13: Q1.D3(IO_L11N_T1_SRCC_35) Q5.62(DQ13)
DQ14: Q1.D1(IO_L10N_T1_AD15N_35) Q5.63(DQ14)
DQ15: Q1.E1(IO_L15N_T2_DQS_35) Q5.65(DQ15)
LDM: Q1.G4(IO_L16N_T2_35) Q5.20(LDM)
LDQS: Q1.K2(IO_L24N_T3_35) Q5.16(LDQS)
RAS: Q1.G5(IO_L16P_T2_35) Q5.23(RAS)
UDM: Q1.F4(IO_L14P_T2_SRCC_35) Q5.47(UDM)
UDQS: Q1.A3(IO_L4N_T0_35) Q5.51(UDQS)
VREF: C19.1 Q5.49(VREF) R37.2 R38.1
WE: Q1.H3(IO_L21N_T3_DQS_35) Q5.21(WE)

Not connected (* = marked no-connect by the designer): Q1 A5(IO_L3P_T0_DQS_AD5P_35) A7(IO_L1N_T0_AD4N_35) B6(IO_L2P_T0_AD12P_35) B7(IO_L1P_T0_AD4P_35) C7(IO_L5P_T0_AD13P_35) D6(IO_L6P_T0_35) E3(IO_L11P_T1_SRCC_35) F3(IO_L14N_T2_SRCC_35)

### Layout directives
differential pair: CK_N, CK_P

### Library data of the parts
C19 = Cap: Capacitor; Published: 8-Jun-2000; LatestRevisionDate: 17-Jul-2002; LatestRevisionNote: Re-released for DXP Platform.; PackageReference: RAD-0.3; Publisher: Altium Limited; PackageDescription: Radial Cap, Thru-Hole; 2 Leads; 0.3 in Pin Spacing
Q5 = DDR256: Supplier 1: Digi-Key
R37 R38 = Res3: Resistor; Published: 8-Jun-2000; LatestRevisionDate: 29-May-2009; LatestRevisionNote: IPC-7351 Footprint Added.; PackageReference: J1-0603; Publisher: Altium Limited; PackageDescription: Chip Resistor; Supplier 1: Digi-Key; Supplier Part Number 1: 1276-4758-1-ND

## Sheet io.SchDoc
size A
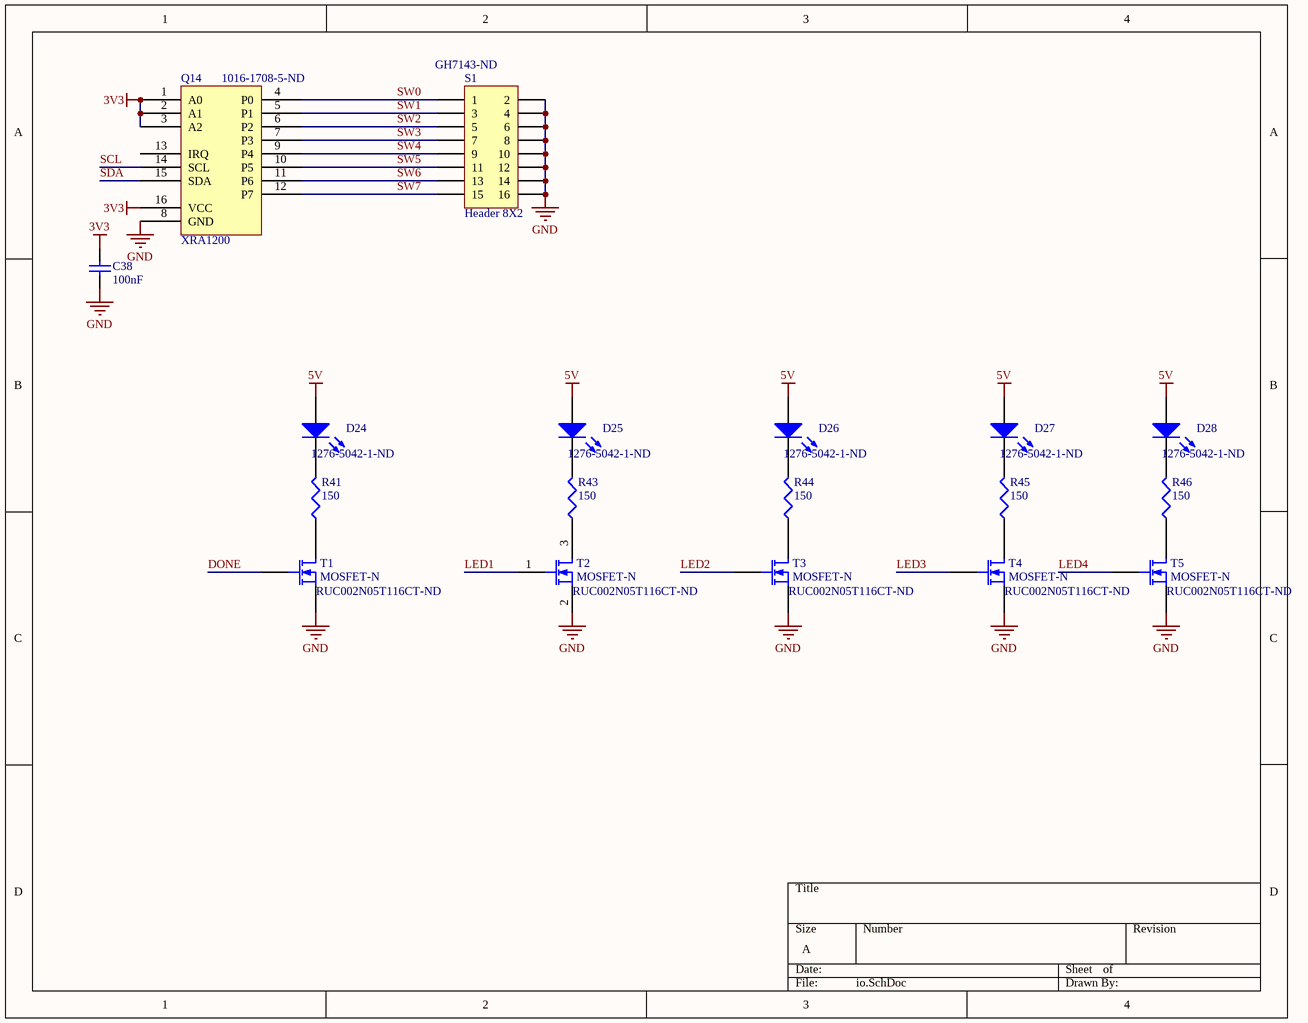
[diagram p5: io.SchDoc]

### Parts
C38  value 100nF  [CAPC1005X06L]  (hidden comment: Cap)
D24  LED2  [LED-0603]  (value not drawn)
D25  LED2  [LED-0603]  (value not drawn)
D26  LED2  [LED-0603]  (value not drawn)
D27  LED2  [LED-0603]  (value not drawn)
D28  LED2  [LED-0603]  (value not drawn)
Q14  XRA1200  Supplier Part Number 1: 1016-1708-5-ND  [TSOP65P640X120-16N]
R41  value 150  Supplier Part Number 1: 1276-5042-1-ND  [CAPC1608X90N]  (hidden comment: Res3)
R43  value 150  Supplier Part Number 1: 1276-5042-1-ND  [CAPC1608X90N]  (hidden comment: Res3)
R44  value 150  Supplier Part Number 1: 1276-5042-1-ND  [CAPC1608X90N]  (hidden comment: Res3)
R45  value 150  Supplier Part Number 1: 1276-5042-1-ND  [CAPC1608X90N]  (hidden comment: Res3)
R46  value 150  Supplier Part Number 1: 1276-5042-1-ND  [CAPC1608X90N]  (hidden comment: Res3)
S1  Header 8X2  Supplier Part Number 1: GH7143-ND  [76PSB08ST]
T1  MOSFET-N  Supplier Part Number 1: RUC002N05T116CT-ND  [SOT23-3]
T2  MOSFET-N  Supplier Part Number 1: RUC002N05T116CT-ND  [SOT23-3]
T3  MOSFET-N  Supplier Part Number 1: RUC002N05T116CT-ND  [SOT23-3]
T4  MOSFET-N  Supplier Part Number 1: RUC002N05T116CT-ND  [SOT23-3]
T5  MOSFET-N  Supplier Part Number 1: RUC002N05T116CT-ND  [SOT23-3]

### Nets
3V3: C38.2 Q14.1(A0) Q14.2(A1) Q14.3(A2) Q14.16(VCC)
5V: D24.A D25.A D26.A D27.A D28.A
GND: C38.1 Q14.8(GND) S1.2 S1.4 S1.6 S1.8 S1.10 S1.12 S1.14 S1.16 T1.2(S) T2.2(S) T3.2(S) T4.2(S) T5.2(S)
DONE: T1.1(G)
LED1: T2.1(G)
LED2: T3.1(G)
LED3: T4.1(G)
LED4: T5.1(G)
SCL: Q14.14(SCL)
SDA: Q14.15(SDA)
SW0: Q14.4(P0) S1.1
SW1: Q14.5(P1) S1.3
SW2: Q14.6(P2) S1.5
SW3: Q14.7(P3) S1.7
SW4: Q14.9(P4) S1.9
SW5: Q14.10(P5) S1.11
SW6: Q14.11(P6) S1.13
SW7: Q14.12(P7) S1.15
NetD24_K: D24.K R41.2
NetD25_K: D25.K R43.2
NetD26_K: D26.K R44.2
NetD27_K: D27.K R45.2
NetD28_K: D28.K R46.2
NetR41_1: R41.1 T1.3(D)
NetR43_1: R43.1 T2.3(D)
NetR44_1: R44.1 T3.3(D)
NetR45_1: R45.1 T4.3(D)
NetR46_1: R46.1 T5.3(D)

Not connected (* = marked no-connect by the designer): Q14 13(IRQ)

### Library data of the parts
C38 = Cap: Capacitor; Published: 8-Jun-2000; LatestRevisionDate: 17-Jul-2002; LatestRevisionNote: Re-released for DXP Platform.; PackageReference: RAD-0.3; Publisher: Altium Limited; PackageDescription: Radial Cap, Thru-Hole; 2 Leads; 0.3 in Pin Spacing
D24-D28 = LED2: Typical RED, GREEN, YELLOW, AMBER GaAs LED; Published: 8-Jun-2000; LatestRevisionDate: 17-Jul-2002; LatestRevisionNote: Re-released for DXP Platform.; PackageVersion: Feb-2002; PackageReference: 3.2X1.6X1.1; Publisher: Altium Limited; PackageDescription: SM LED; 2 Flat Leads; Supplier 1: Digi-Key; Supplier Part Number 1: 475-2512-1-ND
R41 R43-R46 = Res3: Resistor; Published: 8-Jun-2000; LatestRevisionDate: 29-May-2009; LatestRevisionNote: IPC-7351 Footprint Added.; PackageReference: J1-0603; Publisher: Altium Limited; PackageDescription: Chip Resistor; Supplier 1: Digi-Key
S1 = Header 8X2: Header, 8-Pin, Dual row; LatestRevisionDate: 17-Jul-2002; LatestRevisionNote: Re-released for DXP Platform.; Publisher: Altium Limited; Supplier 1: Digi-Key
T1-T5 = MOSFET-N: N-Channel MOSFET; Published: 8-Jun-2000; LatestRevisionDate: 17-Jul-2002; LatestRevisionNote: Re-released for DXP Platform.; PackageVersion: 1995/1996; PackageReference: E3; Publisher: Altium Limited; PackageDescription: TO, Flat Index; 3 In-Line, Axial Leads; Body Dia. 4.6mm; Lead Dia. 0.5 mm (max); Supplier 1: Digi-Key
Q14 = XRA1200: Supplier 1: Digi-Key

## Nets that join several sheets
1V8: power (36 pins), fpga (C2.2 Q1.G8), hdmi (R6.2 R7.2 R8.2)
2V5: power (30 pins), mem (R37.1)
3V3: power (36 pins), input (8 pins), fpga (14 pins), io (5 pins)
5V: power (14 pins), input (L11.1), fpga (J5.15), hdmi (J2.18 R10.1 R11.1), io (5 pins)
GND: power (138 pins), input (50 pins), fpga (20 pins), hdmi (36 pins), mem (C19.2 R38.2), io (15 pins)
P1V8: power (5 pins), input (C86.1 C100.1)
ANINT: input (Q2.1 R16.1), fpga (Q1.P13)
AUDBCK: input (Q3.8), fpga (Q1.R3)
AUDDOUT: input (Q3.9), fpga (Q1.T2)
AUDLRCK: input (Q3.7), fpga (Q1.T4)
AUDSCK: input (Q3.6), fpga (Q1.T3)
DONE: fpga (Q1.H10), io (T1.1)
FIELD: input (Q2.63), fpga (Q1.P15)
HS: input (Q2.2), fpga (Q1.R15)
LED1: hdmi (Q1.C16), io (T2.1)
LED2: hdmi (Q1.D15), io (T3.1)
LED3: hdmi (Q1.D16), io (T4.1)
LED4: hdmi (Q1.E16), io (T5.1)
LLC: input (Q2.20), fpga (Q1.N14)
RESET: input (Q2.51 R13.1), fpga (Q1.P14)
SCL: input (Q2.54 R15.1), fpga (Q1.N13), hdmi (Q4.35), io (Q14.14)
SDA: input (Q2.53 R14.1), fpga (Q1.P11), hdmi (Q4.36), io (Q14.15)
SFL: input (Q2.9), fpga (Q1.R12)
VS: input (Q2.64), fpga (Q1.R16)